# EAGLE design shift (EAGLE 8.5.2)
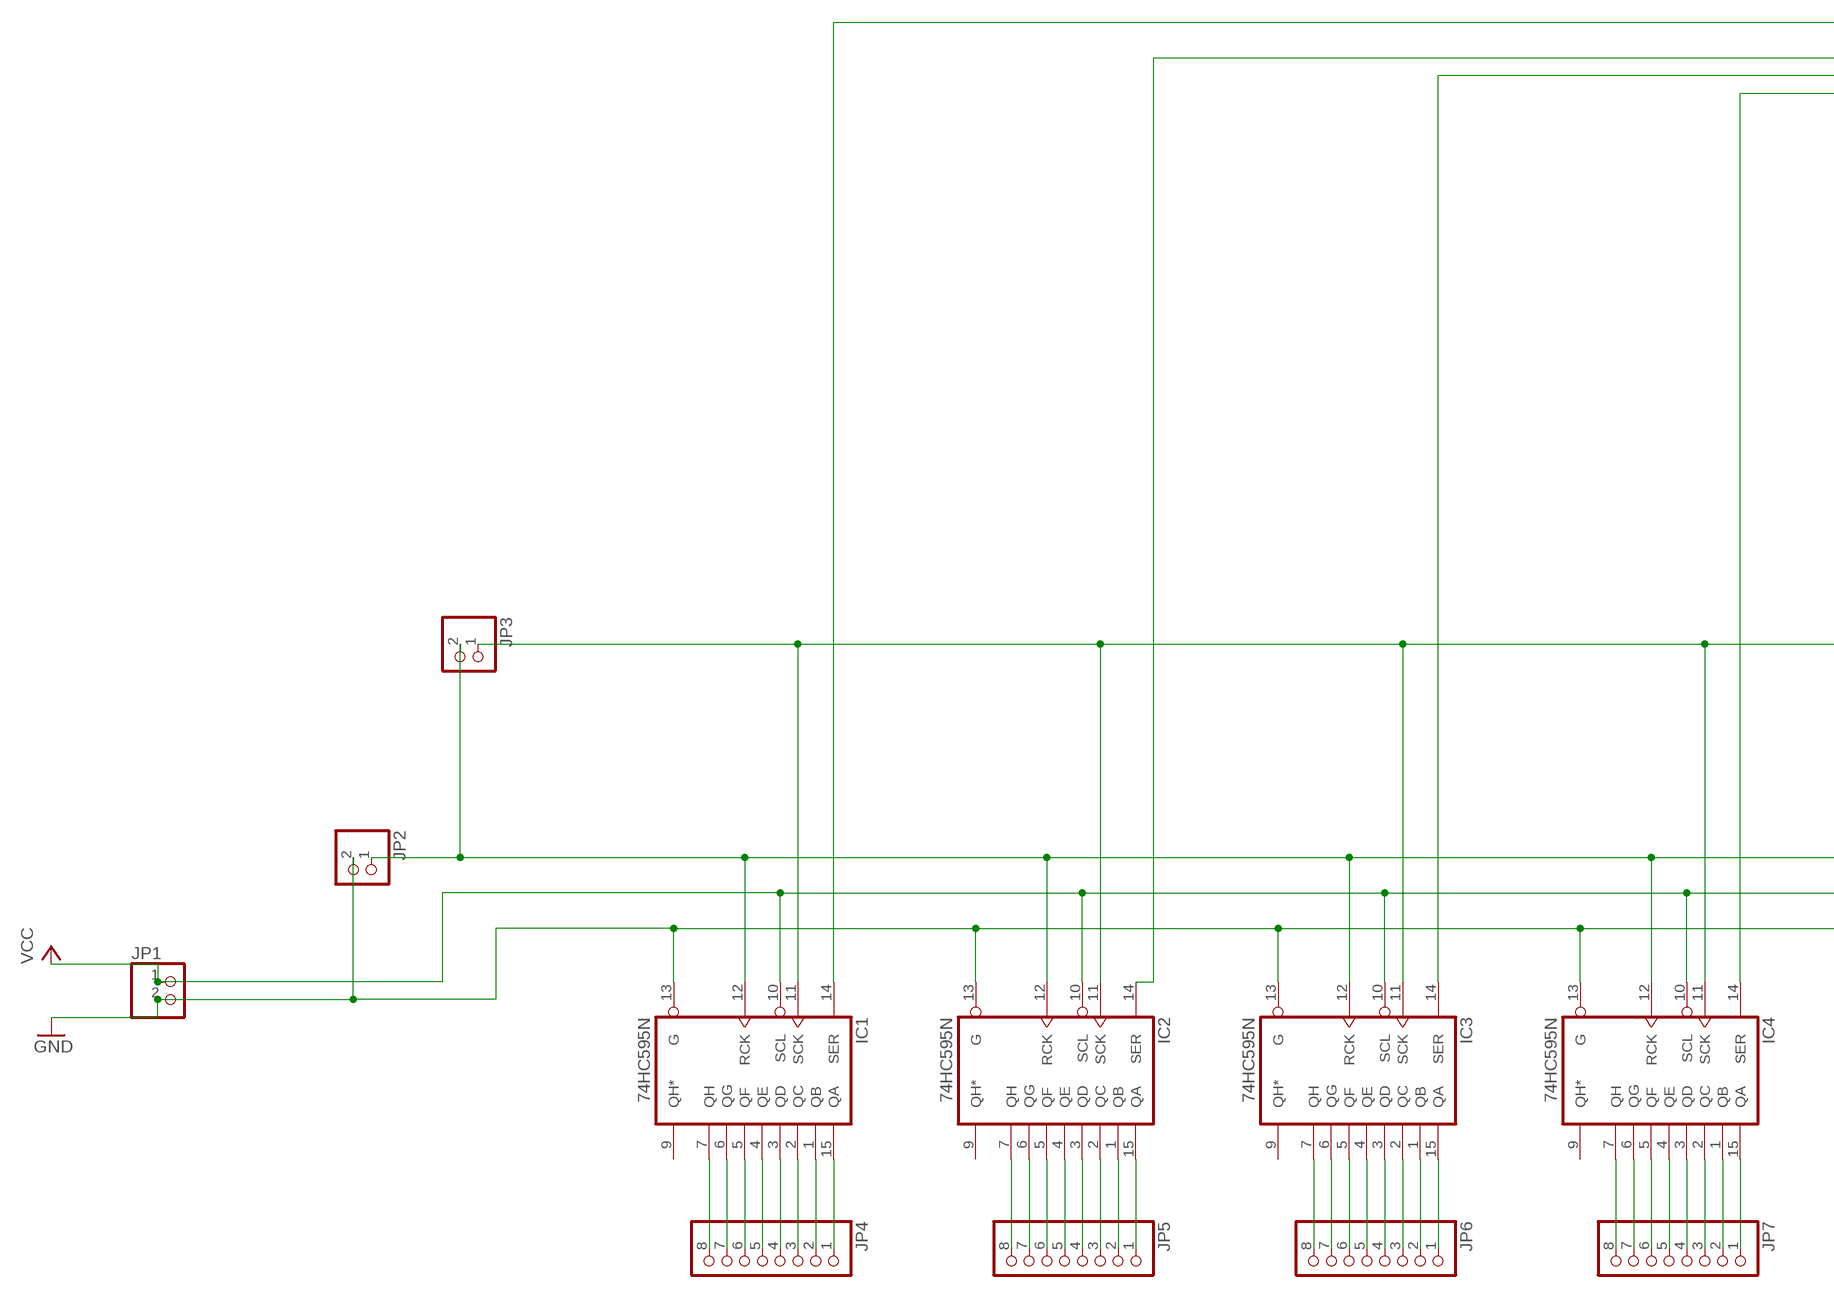
[diagram p0: schematic, sheet 1, part 1 of 2]
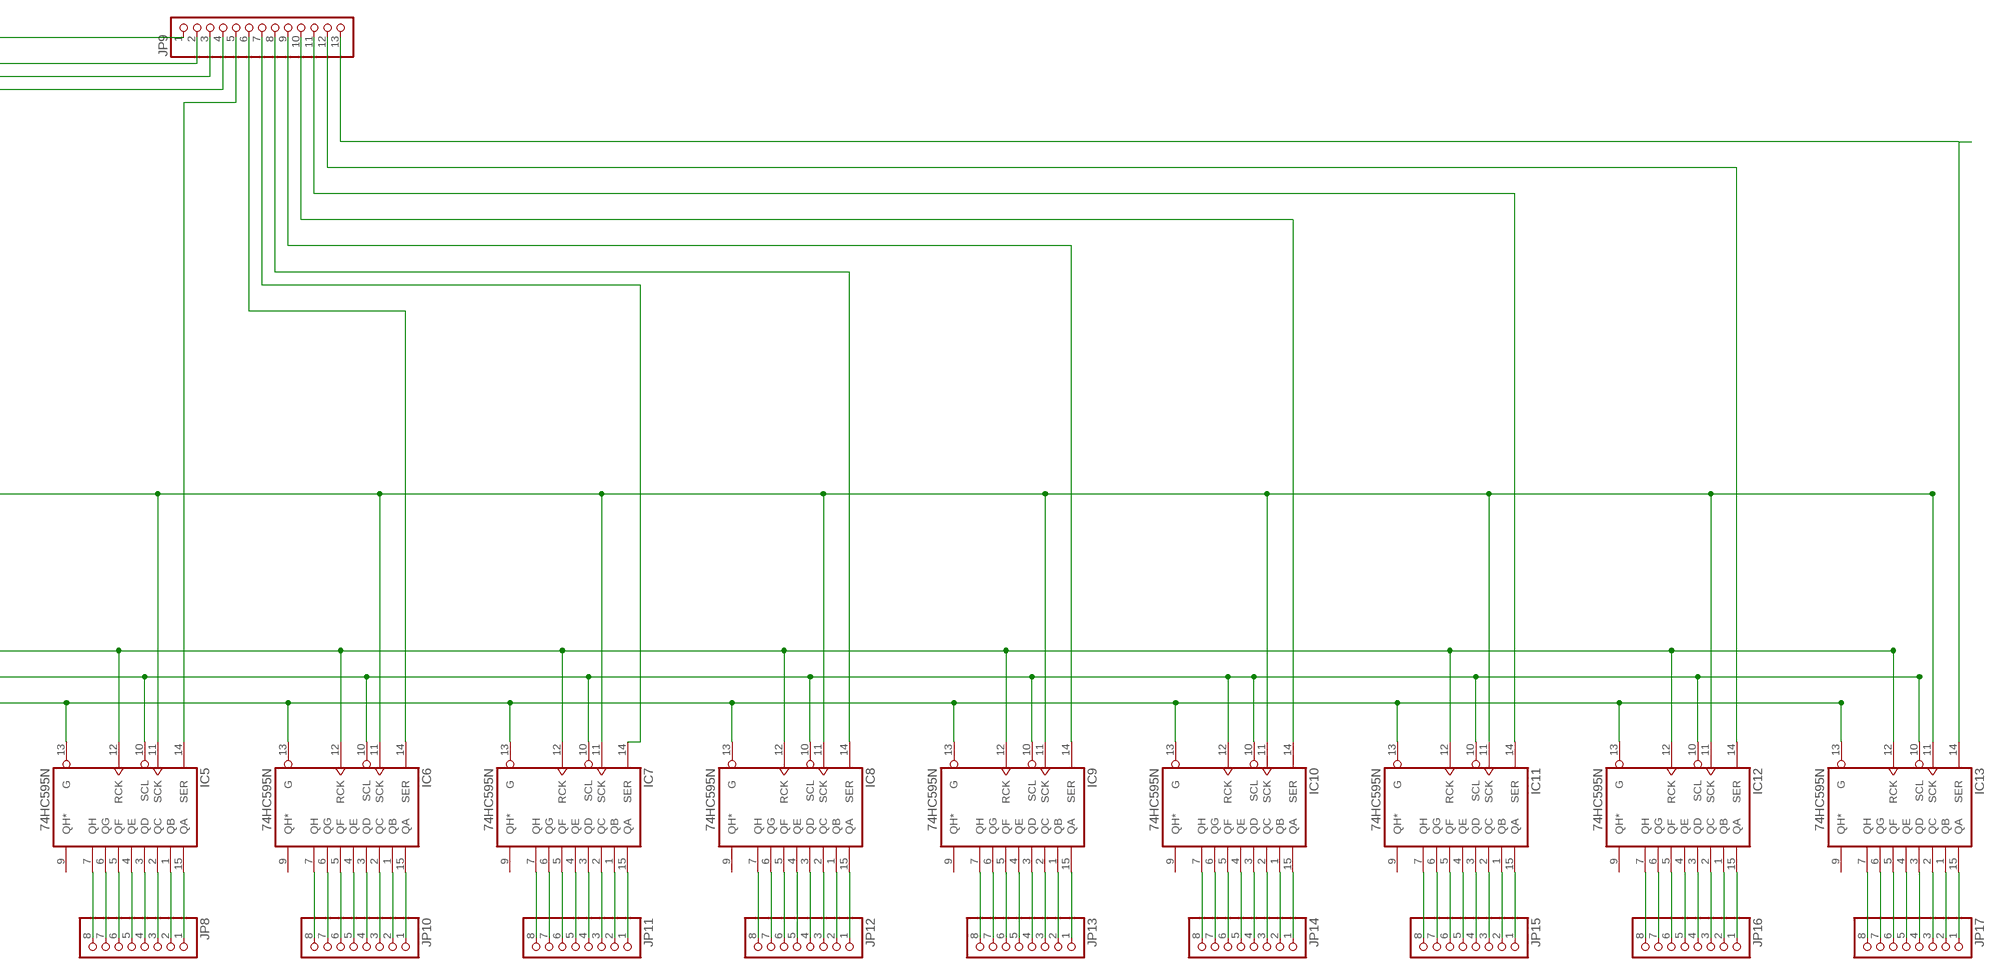
[diagram p1: schematic, sheet 1, part 2 of 2]

## Parts
IC1  74HC595N  [DIL16]
IC2  74HC595N  [DIL16]
IC3  74HC595N  [DIL16]
IC4  74HC595N  [DIL16]
IC5  74HC595N  [DIL16]
IC6  74HC595N  [DIL16]
IC7  74HC595N  [DIL16]
IC8  74HC595N  [DIL16]
IC9  74HC595N  [DIL16]
IC10  74HC595N  [DIL16]
IC11  74HC595N  [DIL16]
IC12  74HC595N  [DIL16]
IC13  74HC595N  [DIL16]
JP1  PINHD-1X2  [1X02]
JP2  PINHD-1X2  [1X02]
JP3  PINHD-1X2  [1X02]
JP4  PINHD-1X8  [1X08]
JP5  PINHD-1X8  [1X08]
JP6  PINHD-1X8  [1X08]
JP7  PINHD-1X8  [1X08]
JP8  PINHD-1X8  [1X08]
JP9  PINHD-1X13  [1X13]
JP10  PINHD-1X8  [1X08]
JP11  PINHD-1X8  [1X08]
JP12  PINHD-1X8  [1X08]
JP13  PINHD-1X8  [1X08]
JP14  PINHD-1X8  [1X08]
JP15  PINHD-1X8  [1X08]
JP16  PINHD-1X8  [1X08]
JP17  PINHD-1X8  [1X08]

## Nets
GND: IC1.13(G) IC2.13(G) IC3.13(G) IC4.13(G) IC5.13(G) IC6.13(G) IC7.13(G) IC8.13(G) IC9.13(G) IC10.13(G) IC11.13(G) IC12.13(G) IC13.13(G) JP1.2 JP2.2
N$1: IC1.7(QH) JP4.8
N$2: IC1.6(QG) JP4.7
N$3: IC1.5(QF) JP4.6
N$4: IC1.4(QE) JP4.5
N$5: IC1.3(QD) JP4.4
N$6: IC1.2(QC) JP4.3
N$7: IC1.1(QB) JP4.2
N$8: IC1.15(QA) JP4.1
N$10: IC1.11(SCK) IC2.11(SCK) IC3.11(SCK) IC4.11(SCK) IC5.11(SCK) IC6.11(SCK) IC7.11(SCK) IC8.11(SCK) IC9.11(SCK) IC10.11(SCK) IC11.11(SCK) IC12.11(SCK) IC13.11(SCK) JP3.1
N$11: IC1.14(SER) JP9.1
N$12: IC2.14(SER) JP9.2
N$13: IC2.7(QH) JP5.8
N$14: IC2.6(QG) JP5.7
N$15: IC2.5(QF) JP5.6
N$16: IC2.4(QE) JP5.5
N$17: IC2.3(QD) JP5.4
N$18: IC2.2(QC) JP5.3
N$19: IC2.1(QB) JP5.2
N$20: IC2.15(QA) JP5.1
N$21: IC3.14(SER) JP9.3
N$22: IC4.14(SER) JP9.4
N$23: IC3.7(QH) JP6.8
N$24: IC3.6(QG) JP6.7
N$25: IC3.5(QF) JP6.6
N$26: IC3.4(QE) JP6.5
N$27: IC3.3(QD) JP6.4
N$28: IC3.2(QC) JP6.3
N$29: IC3.1(QB) JP6.2
N$30: IC3.15(QA) JP6.1
N$31: IC5.14(SER) JP9.5
N$32: IC6.7(QH) JP10.8
N$33: IC4.7(QH) JP7.8
N$34: IC4.6(QG) JP7.7
N$35: IC4.5(QF) JP7.6
N$36: IC4.4(QE) JP7.5
N$37: IC4.3(QD) JP7.4
N$38: IC4.2(QC) JP7.3
N$39: IC4.1(QB) JP7.2
N$40: IC4.15(QA) JP7.1
N$41: IC6.6(QG) JP10.7
N$42: IC6.5(QF) JP10.6
N$43: IC5.7(QH) JP8.8
N$44: IC5.6(QG) JP8.7
N$45: IC5.5(QF) JP8.6
N$46: IC5.4(QE) JP8.5
N$47: IC5.3(QD) JP8.4
N$48: IC5.2(QC) JP8.3
N$49: IC5.1(QB) JP8.2
N$50: IC5.15(QA) JP8.1
N$51: IC6.4(QE) JP10.5
N$52: IC6.3(QD) JP10.4
N$53: IC6.2(QC) JP10.3
N$54: IC6.1(QB) JP10.2
N$55: IC6.15(QA) JP10.1
N$58: IC7.7(QH) JP11.8
N$59: IC7.6(QG) JP11.7
N$60: IC7.5(QF) JP11.6
N$61: IC7.4(QE) JP11.5
N$62: IC7.3(QD) JP11.4
N$63: IC7.2(QC) JP11.3
N$64: IC7.1(QB) JP11.2
N$65: IC7.15(QA) JP11.1
N$66: IC8.7(QH) JP12.8
N$67: IC8.6(QG) JP12.7
N$68: IC8.5(QF) JP12.6
N$69: IC8.4(QE) JP12.5
N$70: IC8.3(QD) JP12.4
N$71: IC8.2(QC) JP12.3
N$72: IC8.1(QB) JP12.2
N$73: IC8.15(QA) JP12.1
N$74: IC9.7(QH) JP13.8
N$75: IC9.6(QG) JP13.7
N$76: IC9.5(QF) JP13.6
N$77: IC9.4(QE) JP13.5
N$78: IC9.3(QD) JP13.4
N$79: IC9.2(QC) JP13.3
N$80: IC9.1(QB) JP13.2
N$81: IC9.15(QA) JP13.1
N$82: IC10.7(QH) JP14.8
N$83: IC10.6(QG) JP14.7
N$84: IC10.5(QF) JP14.6
N$85: IC10.4(QE) JP14.5
N$86: IC10.3(QD) JP14.4
N$87: IC10.2(QC) JP14.3
N$88: IC10.1(QB) JP14.2
N$89: IC10.15(QA) JP14.1
N$90: IC6.14(SER) JP9.6
N$91: IC7.14(SER) JP9.7
N$92: IC8.14(SER) JP9.8
N$93: IC9.14(SER) JP9.9
N$94: IC10.14(SER) JP9.10
N$97: IC11.7(QH) JP15.8
N$98: IC11.6(QG) JP15.7
N$99: IC11.5(QF) JP15.6
N$100: IC11.4(QE) JP15.5
N$101: IC11.3(QD) JP15.4
N$102: IC11.2(QC) JP15.3
N$103: IC11.1(QB) JP15.2
N$104: IC11.15(QA) JP15.1
N$105: IC12.7(QH) JP16.8
N$106: IC12.6(QG) JP16.7
N$107: IC12.5(QF) JP16.6
N$108: IC12.4(QE) JP16.5
N$109: IC12.3(QD) JP16.4
N$110: IC12.2(QC) JP16.3
N$111: IC12.1(QB) JP16.2
N$112: IC12.15(QA) JP16.1
N$113: IC13.7(QH) JP17.8
N$114: IC13.6(QG) JP17.7
N$115: IC13.5(QF) JP17.6
N$116: IC13.4(QE) JP17.5
N$117: IC13.3(QD) JP17.4
N$118: IC13.2(QC) JP17.3
N$119: IC13.1(QB) JP17.2
N$120: IC13.15(QA) JP17.1
N$121: IC11.14(SER) JP9.11
N$122: IC12.14(SER) JP9.12
N$123: IC13.14(SER) JP9.13
N$124: IC1.12(RCK) IC2.12(RCK) IC3.12(RCK) IC4.12(RCK) IC5.12(RCK) IC6.12(RCK) IC7.12(RCK) IC8.12(RCK) IC9.12(RCK) IC11.12(RCK) IC12.12(RCK) IC13.12(RCK) JP2.1 JP3.2
VCC: IC1.10(SCL) IC2.10(SCL) IC3.10(SCL) IC4.10(SCL) IC5.10(SCL) IC6.10(SCL) IC7.10(SCL) IC8.10(SCL) IC9.10(SCL) IC10.10(SCL) IC10.12(RCK) IC11.10(SCL) IC12.10(SCL) IC13.10(SCL) JP1.1
Unconnected: IC1.9(QH*) IC2.9(QH*) IC3.9(QH*) IC4.9(QH*) IC5.9(QH*) IC6.9(QH*) IC7.9(QH*) IC8.9(QH*) IC9.9(QH*) IC10.9(QH*) IC11.9(QH*) IC12.9(QH*) IC13.9(QH*)

## Power pins joined to a net without a drawn wire
GND: IC1.8(GND) IC2.8(GND) IC3.8(GND) IC4.8(GND) IC5.8(GND) IC6.8(GND) IC7.8(GND) IC8.8(GND) IC9.8(GND) IC10.8(GND) IC11.8(GND) IC12.8(GND) IC13.8(GND)
VCC: IC1.16(VCC) IC2.16(VCC) IC3.16(VCC) IC4.16(VCC) IC5.16(VCC) IC6.16(VCC) IC7.16(VCC) IC8.16(VCC) IC9.16(VCC) IC10.16(VCC) IC11.16(VCC) IC12.16(VCC) IC13.16(VCC)

## Library data of the parts
IC1-IC13 = 74xx-eu:74*595: 8-bit SHIFT REGISTER, output latch
JP1-JP3 = pinhead:PINHD-1X2: PIN HEADER
JP4-JP8 JP10-JP17 = pinhead:PINHD-1X8: PIN HEADER
JP9 = pinhead:PINHD-1X13: PIN HEADER

## Net classes
0 default: width 0.5 mm, clearance 0.5 mm

## Board
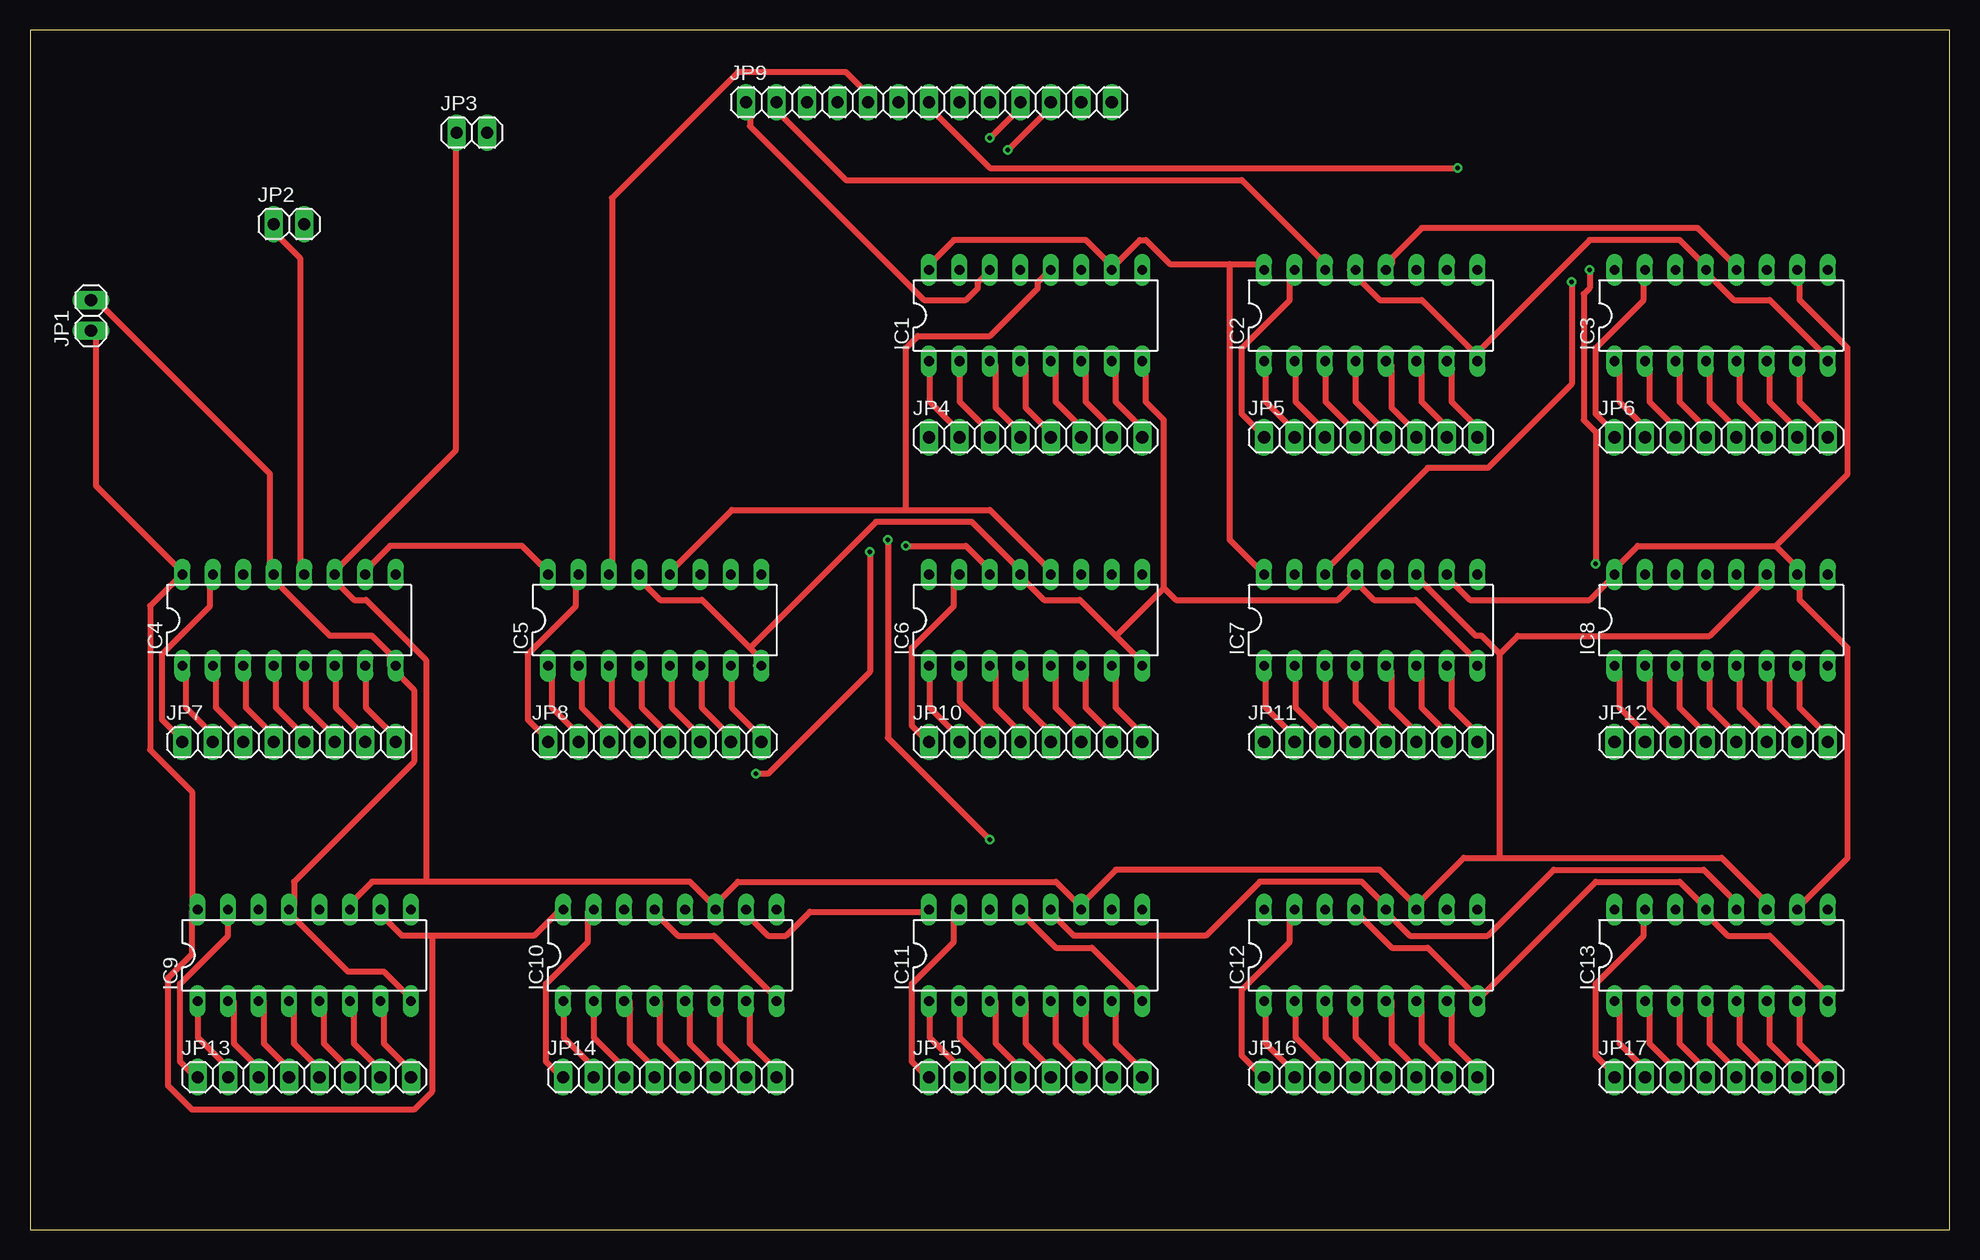
[diagram p2: board, top side]
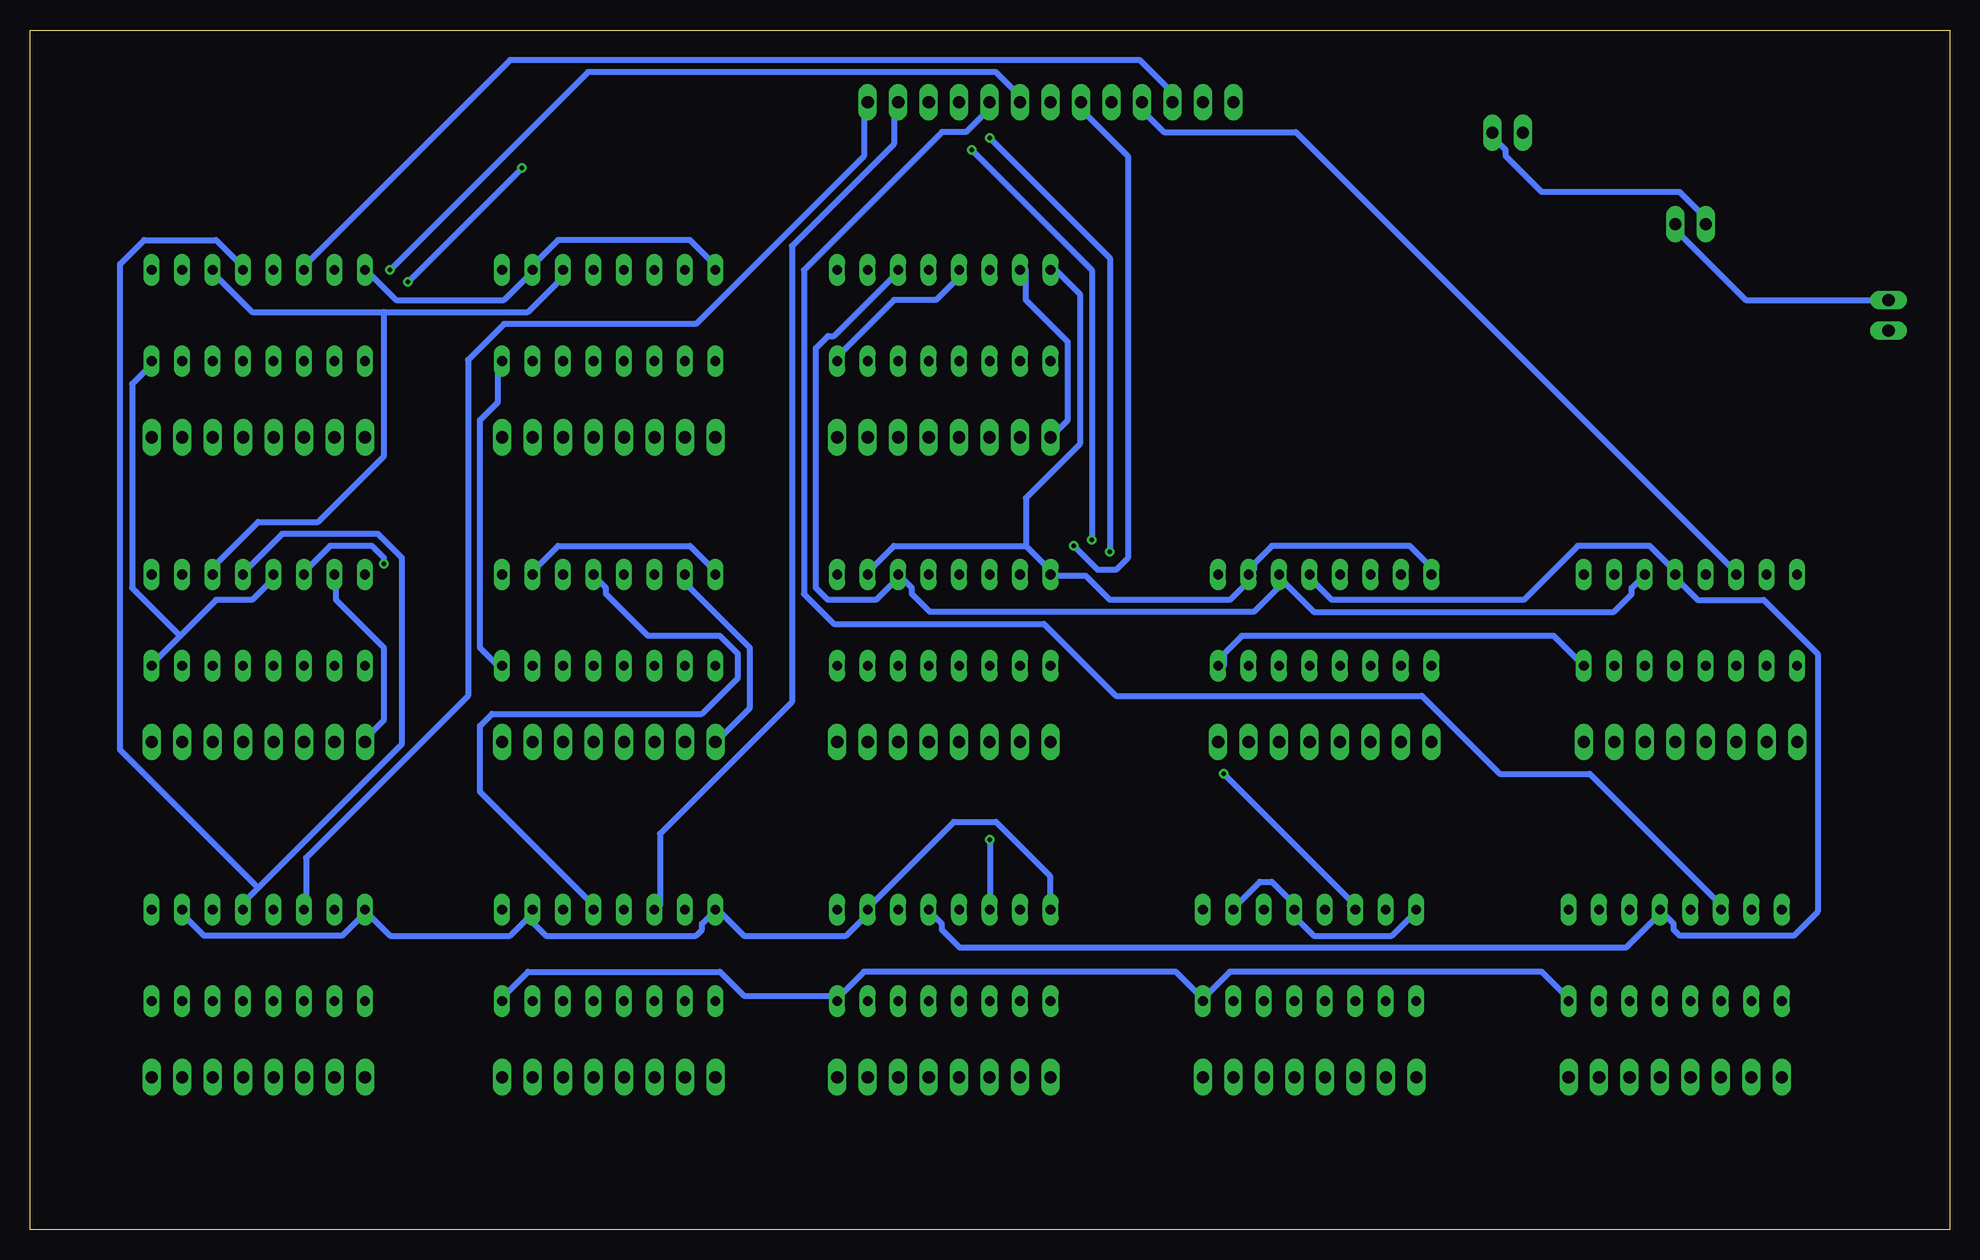
[diagram p3: board, bottom side, seen from below]

Size 160 x 100 mm. Coordinates in mm from the lower left corner, seen from the top.
Outline: 0,0 160,0 160,100 0,100 0,0
Copper layers (1*16): Top 0.035mm / dielectric 1.5mm / Bottom 0.035mm
Design rules "default": minimum track width 6mil, minimum drill 0.35mm, track to track 6mil, track to pad 6mil, pad to pad 6mil, via to via 6mil, smd to smd 6mil, copper to edge 40mil, drill to drill 6mil, minimum pad ring 10mil, minimum via ring 8mil, stop-mask expansion 4mil, vias tented up to drill 0mil, thermal gap 10mil

### Footprints (pad centres in the part's own frame; a part is rotated, then mirrored left to right if it is on the bottom)
DIL16 = drill 0.813 long: 1 -8.89,-3.81; 2 -6.35,-3.81; 3 -3.81,-3.81; 4 -1.27,-3.81; 5 1.27,-3.81; 6 3.81,-3.81; 7 6.35,-3.81; 8 8.89,-3.81; 9 8.89,3.81; 10 6.35,3.81; 11 3.81,3.81; 12 1.27,3.81; 13 -1.27,3.81; 14 -3.81,3.81; 15 -6.35,3.81; 16 -8.89,3.81
1X02 = drill 1.016 long: 1 -1.27,0; 2 1.27,0
1X08 = drill 1.016 long: 1 -8.89,0; 2 -6.35,0; 3 -3.81,0; 4 -1.27,0; 5 1.27,0; 6 3.81,0; 7 6.35,0; 8 8.89,0
1X13 = drill 1.016 long: 1 -15.24,0; 2 -12.7,0; 3 -10.16,0; 4 -7.62,0; 5 -5.08,0; 6 -2.54,0; 7 0,0; 8 2.54,0; 9 5.08,0; 10 7.62,0; 11 10.16,0; 12 12.7,0; 13 15.24,0

### Placement (x,y rotation side)
IC1  83.82,76.2 0 top
IC2  111.76,76.2 0 top
IC3  140.97,76.2 0 top
IC4  21.59,50.8 0 top
IC5  52.07,50.8 0 top
IC6  83.82,50.8 0 top
IC7  111.76,50.8 0 top
IC8  140.97,50.8 0 top
IC9  22.86,22.86 0 top
IC10  53.34,22.86 0 top
IC11  83.82,22.86 0 top
IC12  111.76,22.86 0 top
IC13  140.97,22.86 0 top
JP1  5.08,76.2 90 top
JP2  21.59,83.82 0 top
JP3  36.83,91.44 0 top
JP4  83.82,66.04 0 top
JP5  111.76,66.04 0 top
JP6  140.97,66.04 0 top
JP7  21.59,40.64 0 top
JP8  52.07,40.64 0 top
JP9  74.93,93.98 0 top
JP10  83.82,40.64 0 top
JP11  111.76,40.64 0 top
JP12  140.97,40.64 0 top
JP13  22.86,12.7 0 top
JP14  53.34,12.7 0 top
JP15  83.82,12.7 0 top
JP16  111.76,12.7 0 top
JP17  140.97,12.7 0 top

### Tracks (layer width: path | path; a pad name or v marks a point on that pad's centre or on a via)
GND
  Top 0.5: 120.5,73 120.5,72.5 IC2.8 120.5,73 | 120.5,73 116,77.5 112.5,77.5 110,80 IC2.13 | IC3.8 149.5,72.5 149.5,73 145,77.5 142,77.5 139.5,80 IC3.13 139.5,80.5 137.5,82.5 130,82.5 120.5,73 | 110.5,54 110,54.5 IC7.13 110.5,54 | 110.5,54 112,52.5 115.5,52.5 120.5,47.5 120.5,47 IC7.8 | 60,48.5 56,52.5 52.5,52.5 50.5,54.5 IC5.13 | 60,48.5 60.5,48 60.5,47 IC5.8 | 90.5,49.5 87.5,52.5 84.5,52.5 82.5,54.5 IC6.13 82.5,55 78.5,59 70.5,59 60,48.5 | 90.5,49.5 92.5,47.5 92.5,47 IC6.8 | 94.5,53.5 94.5,67.5 93,69 93,72 IC1.8 | 90.5,49.5 94.5,53.5 | 110.5,54 109,52.5 95.5,52.5 94.5,53.5 | IC13.8 149.5,19.5 149.5,20 145,24.5 141.5,24.5 139.5,26.5 IC13.13 139.5,27 137.5,29 130.5,29 121,19.5 IC12.8 120.5,19.5 116.5,23.5 113.5,23.5 110.5,26.5 IC12.13 | IC11.8 92.5,19.5 88.5,23.5 85.5,23.5 82.5,26.5 IC11.13 | IC10.8 62,19.5 57,24.5 54,24.5 52,26.5 IC10.13 | IC9.8 31.5,19.5 29.5,21.5 26.5,21.5 22,26 22,26.5 IC9.13 22,27 22,29 32,39 32,45 30.5,46.5 IC4.8 30,47 30,48 28.5,49.5 25,49.5 20.5,54 20.5,54.5 IC4.13 20,55 20,63 6,77 5.5,77 JP1.2
  Bottom 0.5: 147.5,49.5 144.5,52.5 141.5,52.5 139.5,54.5 IC8.13 | 147.5,49.5 149.5,47.5 149.5,47 IC8.8 | 147.5,49.5 151.5,53.5 151.5,70.5 150,72 IC3.8 | IC1.8 92.5,72.5 92.5,73 88,77.5 84.5,77.5 83,79 83,80 IC1.13 | IC2.8 121,72 121,69 122.5,67.5 122.5,48.5 121,47 IC7.8 | IC12.8 120.5,19.5 118.5,21.5 102.5,21.5 100.5,19.5 93,19.5 IC11.8 92.5,19.5 90.5,21.5 64.5,21.5 62.5,19.5 IC10.8 62,19.5 60,21.5 34,21.5 32,19.5 IC9.8 | JP1.2 5.5,77.5 17,77.5 23,83.5 JP2.2 | IC5.8 60.5,47 60.5,48 59,49.5 33,49.5 30.5,47 IC4.8
N$1
  Top 0.5: IC1.7 90.5,72 90.5,69 93,66.5 JP4.8
N$2
  Top 0.5: IC1.6 88,72 88,69 90.5,66.5 JP4.7
N$3
  Top 0.5: IC1.5 85.5,72 85.5,69 88,66.5 JP4.6
N$4
  Top 0.5: IC1.4 83,72 83,68.5 85,66.5 JP4.5
N$5
  Top 0.5: IC1.3 80.5,72 80.5,68.5 82.5,66.5 JP4.4
N$6
  Top 0.5: IC1.2 77.5,72 77.5,69 80,66.5 JP4.3
N$7
  Top 0.5: IC1.1 75,72 75,69 77.5,66.5 JP4.2
N$8
  Bottom 0.5: IC1.15 77,80 77,77.5 73.5,74 73.5,67.5 74.5,66.5 JP4.1
N$10
  Top 0.5: 115.5,27 112.5,30 90.5,30 88,27.5 88,27 IC11.11 87.5,27 85.5,29 59,29 57,27 | 122.5,31 119.5,31 115.5,27 | 122.5,31 141,31 144.5,27.5 144.5,27 IC13.11 | 115.5,27 IC12.11 | 122.5,48 121,49.5 120.5,49.5 116,54 116,54.5 IC7.11 | 122.5,31 122.5,48 | 122.5,48 124,49.5 140,49.5 144.5,54 144.5,54.5 IC8.11 | 33,29 55,29 57,27 | 33,29 28.5,29 27,27.5 27,27 IC9.11 | JP3.1 35.5,91 35.5,65 25.5,55 IC4.11 25,54.5 27,52.5 28,52.5 33,47.5 33,29 | 57,27 IC10.11
  Bottom 0.5: 130.5,76.5 141.5,76.5 145,80 IC3.11 | 130.5,76.5 118.5,76.5 116,79 116,80 IC2.11 | 130.5,76.5 130.5,64.5 136,59 141,59 145,55 IC8.11 | 55.5,54 56,54.5 IC5.11 55.5,54 | 55.5,54 53,51.5 28,51.5 26.5,53 26.5,53.5 25.5,54.5 IC4.11 | 87.5,54.5 86.5,53.5 86.5,53 85,51.5 58,51.5 55.5,54 | 87.5,54.5 89.5,52.5 93.5,52.5 94.5,53.5 94.5,73.5 93.5,74.5 93,74.5 88,79.5 88,80 IC1.11 | 87.5,54.5 IC6.11
N$11
  Top 0.5: IC1.14 79,79 79,78.5 78,77.5 74.5,77.5 60,92 60,93.5 JP9.1
N$12
  Top 0.5: IC2.14 107.5,80.5 107.5,81 101,87.5 68,87.5 62,93.5 JP9.2
N$13
  Top 0.5: IC2.7 118.5,72 118.5,69 121,66.5 JP5.8
N$14
  Top 0.5: IC2.6 116,72 116,69 118.5,66.5 JP5.7
N$15
  Top 0.5: IC2.5 113.5,72 113.5,68.5 115.5,66.5 JP5.6
N$16
  Top 0.5: IC2.4 110.5,72 110.5,69 113,66.5 JP5.5
N$17
  Top 0.5: IC2.3 108,72 108,69 110.5,66.5 JP5.4
N$18
  Top 0.5: IC2.2 105.5,72 105.5,69 108,66.5 JP5.3
N$19
  Top 0.5: IC2.1 103,72 103,69 105.5,66.5 JP5.2
N$20
  Top 0.5: IC2.15 105,80 105,77.5 101,73.5 101,68 102.5,66.5 JP5.1
N$21
  Bottom 0.5: IC3.14 137,80.5 120,97.5 67.5,97.5 65,95 65,94 JP9.3
N$22
  Bottom 0.5: IC4.14 18,55 54.5,91.5 65.5,91.5 67.5,93.5 JP9.4
N$23
  Top 0.5: IC3.7 147.5,72 147.5,69 150,66.5 JP6.8
N$24
  Top 0.5: IC3.6 145,72 145,69 147.5,66.5 JP6.7
N$25
  Top 0.5: IC3.5 142.5,72 142.5,69 145,66.5 JP6.6
N$26
  Top 0.5: IC3.4 140,72 140,69 142.5,66.5 JP6.5
N$27
  Top 0.5: IC3.3 137.5,72 137.5,69 140,66.5 JP6.4
N$28
  Top 0.5: IC3.2 135,72 135,69 137.5,66.5 JP6.3
N$29
  Top 0.5: IC3.1 132.5,72 132.5,69 135,66.5 JP6.2
N$30
  Top 0.5: IC3.15 134.5,80 134.5,77.5 130.5,73.5 130.5,68 132,66.5 JP6.1
N$31
  Top 0.5: IC5.14 48.5,55 48.5,86 59,96.5 68,96.5 69.5,95 69.5,94 JP9.5
N$32
  Top 0.5: IC6.7 90.5,46.5 90.5,43.5 93,41 JP10.8
N$33
  Top 0.5: IC4.7 28,46.5 28,43.5 30.5,41 JP7.8
N$34
  Top 0.5: IC4.6 25.5,46.5 25.5,43.5 28,41 JP7.7
N$35
  Top 0.5: IC4.5 23,46.5 23,43.5 25.5,41 JP7.6
N$36
  Top 0.5: IC4.4 20.5,46.5 20.5,43.5 23,41 JP7.5
N$37
  Top 0.5: IC4.3 18,46.5 18,43.5 20.5,41 JP7.4
N$38
  Top 0.5: IC4.2 15.5,46.5 15.5,43.5 18,41 JP7.3
N$39
  Top 0.5: IC4.1 13,46.5 13,43.5 15.5,41 JP7.2
N$40
  Top 0.5: IC4.15 15,54.5 15,52 11,48 11,42.5 12.5,41 JP7.1
N$41
  Top 0.5: IC6.6 88,46.5 88,43.5 90.5,41 JP10.7
N$42
  Top 0.5: IC6.5 85.5,46.5 85.5,43.5 88,41 JP10.6
N$43
  Top 0.5: IC5.7 58.5,46.5 58.5,43.5 61,41 JP8.8
N$44
  Top 0.5: IC5.6 56,46.5 56,43.5 58.5,41 JP8.7
N$45
  Top 0.5: IC5.5 53.5,46.5 53.5,43.5 56,41 JP8.6
N$46
  Top 0.5: IC5.4 51,46.5 51,43.5 53.5,41 JP8.5
N$47
  Top 0.5: IC5.3 48.5,46.5 48.5,43.5 51,41 JP8.4
N$48
  Top 0.5: IC5.2 46,46.5 46,43.5 48.5,41 JP8.3
N$49
  Top 0.5: IC5.1 43.5,46.5 43.5,43.5 46,41 JP8.2
N$50
  Top 0.5: IC5.15 45.5,54.5 45.5,52 41.5,48 41.5,42.5 43,41 JP8.1
N$51
  Top 0.5: IC6.4 83,46.5 83,43.5 85.5,41 JP10.5
N$52
  Top 0.5: IC6.3 80.5,46.5 80.5,43.5 83,41 JP10.4
N$53
  Top 0.5: IC6.2 77.5,46.5 77.5,44 80.5,41 JP10.3
N$54
  Top 0.5: IC6.1 75,46.5 75,43.5 77.5,41 JP10.2
N$55
  Top 0.5: IC6.15 77,54.5 77,52 73.5,48.5 73.5,42 74.5,41 JP10.1
N$58
  Top 0.5: IC7.7 118.5,46.5 118.5,43.5 121,41 JP11.8
N$59
  Top 0.5: IC7.6 116,46.5 116,43.5 118.5,41 JP11.7
N$60
  Top 0.5: IC7.5 113.5,46.5 113.5,43.5 116,41 JP11.6
N$61
  Top 0.5: IC7.4 110.5,46.5 110.5,44 113.5,41 JP11.5
N$62
  Top 0.5: IC7.3 108,46.5 108,43.5 110.5,41 JP11.4
N$63
  Top 0.5: IC7.2 105.5,46.5 105.5,43.5 108,41 JP11.3
N$64
  Top 0.5: IC7.1 103,46.5 103,43.5 105.5,41 JP11.2
N$65
  Bottom 0.5: IC7.15 105,54.5 105,53.5 100,48.5 100,43.5 102.5,41 JP11.1
N$66
  Top 0.5: IC8.7 147.5,46.5 147.5,43.5 150,41 JP12.8
N$67
  Top 0.5: IC8.6 145,46.5 145,43.5 147.5,41 JP12.7
N$68
  Top 0.5: IC8.5 142.5,46.5 142.5,43.5 145,41 JP12.6
N$69
  Top 0.5: IC8.4 140,46.5 140,43.5 142.5,41 JP12.5
N$70
  Top 0.5: IC8.3 137.5,46.5 137.5,43.5 140,41 JP12.4
N$71
  Top 0.5: IC8.2 135,46.5 135,43.5 137.5,41 JP12.3
N$72
  Top 0.5: IC8.1 132.5,46.5 132.5,43.5 135,41 JP12.2
N$73
  Bottom 0.5: IC8.15 134.5,54.5 134.5,52.5 130.5,48.5 130.5,42.5 132,41 JP12.1
N$74
  Top 0.5: IC9.7 29.5,19 29.5,15.5 32,13 JP13.8
N$75
  Top 0.5: IC9.6 27,19 27,15.5 29.5,13 JP13.7
N$76
  Top 0.5: IC9.5 24.5,19 24.5,15.5 27,13 JP13.6
N$77
  Top 0.5: IC9.4 22,19 22,15.5 24.5,13 JP13.5
N$78
  Top 0.5: IC9.3 19.5,19 19.5,15.5 22,13 JP13.4
N$79
  Top 0.5: IC9.2 17,19 17,15.5 19.5,13 JP13.3
N$80
  Top 0.5: IC9.1 14,19 14,16 17,13 JP13.2
N$81
  Top 0.5: IC9.15 16.5,26.5 16.5,24.5 12.5,20.5 12.5,14 13.5,13 JP13.1
N$82
  Top 0.5: IC10.7 60,19 60,15.5 62.5,13 JP14.8
N$83
  Top 0.5: IC10.6 57.5,19 57.5,15.5 60,13 JP14.7
N$84
  Top 0.5: IC10.5 55,19 55,15.5 57.5,13 JP14.6
N$85
  Top 0.5: IC10.4 52.5,19 52.5,15.5 55,13 JP14.5
N$86
  Top 0.5: IC10.3 50,19 50,15.5 52.5,13 JP14.4
N$87
  Top 0.5: IC10.2 47,19 47,16 50,13 JP14.3
N$88
  Top 0.5: IC10.1 44.5,19 44.5,16 46.5,14 46.5,13 JP14.2
N$89
  Top 0.5: IC10.15 46.5,26.5 46.5,24 43,20.5 43,14 44,13 JP14.1
N$90  (via drill 0.35)
  Top 0.5: v73,57 78,57 80,55 IC6.14
  Bottom 0.5: v73,57 71,55 69.5,55 68.5,56 68.5,89.5 72.5,93.5 JP9.6
N$91  (via drill 0.35)
  Top 0.5: v128.5,79 128.5,70.5 121.5,63.5 116.5,63.5 108,55 IC7.14 | v119,88.5 80,88.5 75,93.5 JP9.7
  Bottom 0.5: v119,88.5 v128.5,79
N$92  (via drill 0.35)
  Top 0.5: v130.5,55.5 130.5,66.5 129.5,67.5 129.5,78 130,78.5 v130,80
  Bottom 0.5: v130.5,55.5 130.5,56 131.5,57 135,57 137,55 IC8.14 | v130,80 113.5,96.5 79.5,96.5 77,94 JP9.8
N$93
  Bottom 0.5: IC9.14 19.5,27 19.5,27.5 30,38 37.5,38 44,44.5 69.5,44.5 75.5,50.5 93,50.5 95.5,53 95.5,80 84,91.5 82,91.5 80,93.5 JP9.9
N$94  (via drill 0.35)
  Top 0.5: v60.5,38 61.5,38 70,46.5 v70,56.5 | v80,91 82.5,93.5 JP9.10
  Bottom 0.5: v60.5,38 50,27.5 50,27 IC10.14 | v70,56.5 70,81 v80,91
N$97
  Top 0.5: IC11.7 90.5,19 90.5,15.5 93,13 JP15.8
N$98
  Top 0.5: IC11.6 88,19 88,15.5 90.5,13 JP15.7
N$99
  Top 0.5: IC11.5 85.5,19 85.5,15.5 88,13 JP15.6
N$100
  Top 0.5: IC11.4 83,19 83,15.5 85.5,13 JP15.5
N$101
  Top 0.5: IC11.3 80.5,19 80.5,15.5 83,13 JP15.4
N$102
  Top 0.5: IC11.2 77.5,19 77.5,16 80.5,13 JP15.3
N$103
  Top 0.5: IC11.1 75,19 75,16 77,14 77,13 JP15.2
N$104
  Top 0.5: IC11.15 77,26.5 77,24 73.5,20.5 73.5,14 74.5,13 JP15.1
N$105
  Top 0.5: IC12.7 118.5,19 118.5,15.5 121,13 JP16.8
N$106
  Top 0.5: IC12.6 116,19 116,15.5 118.5,13 JP16.7
N$107
  Top 0.5: IC12.5 113.5,19 113.5,15.5 116,13 JP16.6
N$108
  Top 0.5: IC12.4 110.5,19 110.5,16 113.5,13 JP16.5
N$109
  Top 0.5: IC12.3 108,19 108,16 110,14 110,13 JP16.4
N$110
  Top 0.5: IC12.2 105.5,19 105.5,16 107.5,14 107.5,13 JP16.3
N$111
  Top 0.5: IC12.1 103,19 103,15.5 105.5,13 JP16.2
N$112
  Top 0.5: IC12.15 105,26.5 105,24 101,20 101,14.5 102.5,13 JP16.1
N$113
  Top 0.5: IC13.7 147.5,19 147.5,15.5 150,13 JP17.8
N$114
  Top 0.5: IC13.6 145,19 145,15.5 147.5,13 JP17.7
N$115
  Top 0.5: IC13.5 142.5,19 142.5,15.5 145,13 JP17.6
N$116
  Top 0.5: IC13.4 140,19 140,15.5 142.5,13 JP17.5
N$117
  Top 0.5: IC13.3 137.5,19 137.5,15.5 140,13 JP17.4
N$118
  Top 0.5: IC13.2 135,19 135,15.5 137.5,13 JP17.3
N$119
  Top 0.5: IC13.1 132.5,19 132.5,15.5 135,13 JP17.2
N$120
  Top 0.5: IC13.15 134.5,26.5 134.5,24.5 130.5,20.5 130.5,14.5 132,13 JP17.1
N$121  (via drill 0.35)
  Top 0.5: v80,32.5 71.5,41 v71.5,57.5 | v81.5,90 85,93.5 JP9.11
  Bottom 0.5: v80,32.5 80,27 IC11.14 | v71.5,57.5 71.5,80 v81.5,90
N$122
  Bottom 0.5: IC12.14 107.5,27 107.5,33 96.5,44 96.5,82 88,90.5 88,93.5 JP9.12
N$123
  Bottom 0.5: IC13.14 137,27 137,31 123.5,44.5 123.5,72.5 120.5,75.5 104.5,75.5 90.5,89.5 90.5,93.5 JP9.13
N$124
  Top 0.5: IC2.12 113.5,80.5 113.5,81 116,83.5 139,83.5 142,80.5 IC3.12 | IC11.12 85.5,26.5 85.5,26 87,24.5 98,24.5 102.5,29 111,29 113,27 IC12.12 113,26.5 115,24.5 121.5,24.5 127,30 139.5,30 142,27.5 142,27 IC13.12 | IC4.12 22.5,55 22.5,81 20,83.5 JP2.1 | 73,60 58.5,60 53.5,55 IC5.12 | 73,60 80,60 85,55 IC6.12 | 73,60 73,73.5 74,74.5 80,74.5 84,78.5 84,79 85,80 IC1.12
  Bottom 0.5: IC7.12 113,54.5 112,53.5 112,53 108.5,49.5 102.5,49.5 101,48 101,46 104,43 121.5,43 122.5,42 122.5,36.5 113,27 IC12.12 | 141,28.5 142.5,27 IC13.12 | 141,28.5 129,40.5 129,56 131,58 139,58 142,55 IC8.12 | 141,28.5 152.5,40 152.5,80.5 150.5,82.5 144.5,82.5 142.5,80.5 IC3.12 | 24,26.5 23,25.5 23,25 22.5,24.5 13,24.5 11,26.5 11,48 15.5,52.5 21,52.5 23,54.5 IC4.12 23,55 25,57 31,57 35.5,52.5 51.5,52.5 53,54 53,54.5 IC5.12 | JP3.2 38,91 37,90 37,89.5 34,86.5 22.5,86.5 20,84 JP2.1 | 24,26.5 27,23.5 82.5,23.5 84,25 84,25.5 85,26.5 IC11.12 | 24,26.5 IC9.12
VCC
  Top 0.5: IC4.10 28,55 30,57 41,57 43,55 IC5.16 | IC1.16 75,80.5 77,82.5 88,82.5 90,80.5 IC1.10 90.5,80.5 92.5,82.5 93,82.5 95,80.5 100,80.5 | 100,80.5 102.5,80.5 IC2.16 | IC7.10 118,54.5 120,52.5 130,52.5 132,54.5 IC8.16 132,55 134,57 145.5,57 | 145.5,57 147,55.5 147,55 IC8.10 147.5,54.5 147.5,52.5 151.5,48.5 151.5,31 147.5,27 IC13.10 | 145.5,57 151.5,63 151.5,73.5 147.5,77.5 147.5,80 IC3.10 | 100,80.5 100,57.5 102.5,55 IC7.16 | JP1.1 5.5,74.5 5.5,62 12.5,55 IC4.16 12.5,54.5 10,52 10,40 13.5,36.5 13.5,27 IC9.16 13.5,26.5 13.5,23 11.5,21 11.5,12 13.5,10 32,10 33.5,11.5 33.5,24.5 | 33.5,24.5 42,24.5 44,26.5 IC10.16 | 33.5,24.5 31,24.5 29.5,26 29.5,26.5 IC9.10 | IC11.16 74.5,26.5 65,26.5 63,24.5 61.5,24.5 59.5,26.5 IC10.10
  Bottom 0.5: 77,57 75,55 IC6.16 74.5,54.5 72,54.5 70,52.5 60,52.5 58,54.5 IC5.10 58,55 58,55.5 56.5,57 45,57 43,55 IC5.16 | 77,57 88,57 90,55 IC6.10 | IC3.16 132,80 129.5,77.5 120.5,77.5 118.5,79.5 118.5,80 IC2.10 118,80.5 116,82.5 105,82.5 103,80.5 IC2.16 | IC7.16 103,55 105,57 116,57 118,55 IC7.10 | 77,57 77,61 72.5,65.5 72.5,78 74.5,80 IC1.16 | IC10.10 59.5,27 57.5,29 56.5,29 55,27.5 55,27 IC10.12 55,26.5 53,24.5 46.5,24.5 44.5,26.5 IC10.16 | 118.5,26 118.5,26.5 IC12.10 118.5,26 | 118.5,26 120,24.5 130,24.5 132,26.5 | 132,26.5 134,24.5 145.5,24.5 147,26 147,26.5 IC13.10 | 132,26.5 IC13.16 | 118.5,26 117,24.5 104.5,24.5 104,25 104,25.5 103,26.5 IC12.16 102.5,26.5 100.5,24.5 92,24.5 90.5,26 90.5,26.5 IC11.10 90,27 83,34 79.5,34 75,29.5 75,27 IC11.16